# Altium schematic sheet STM32F103ZE.SchDoc
size A3
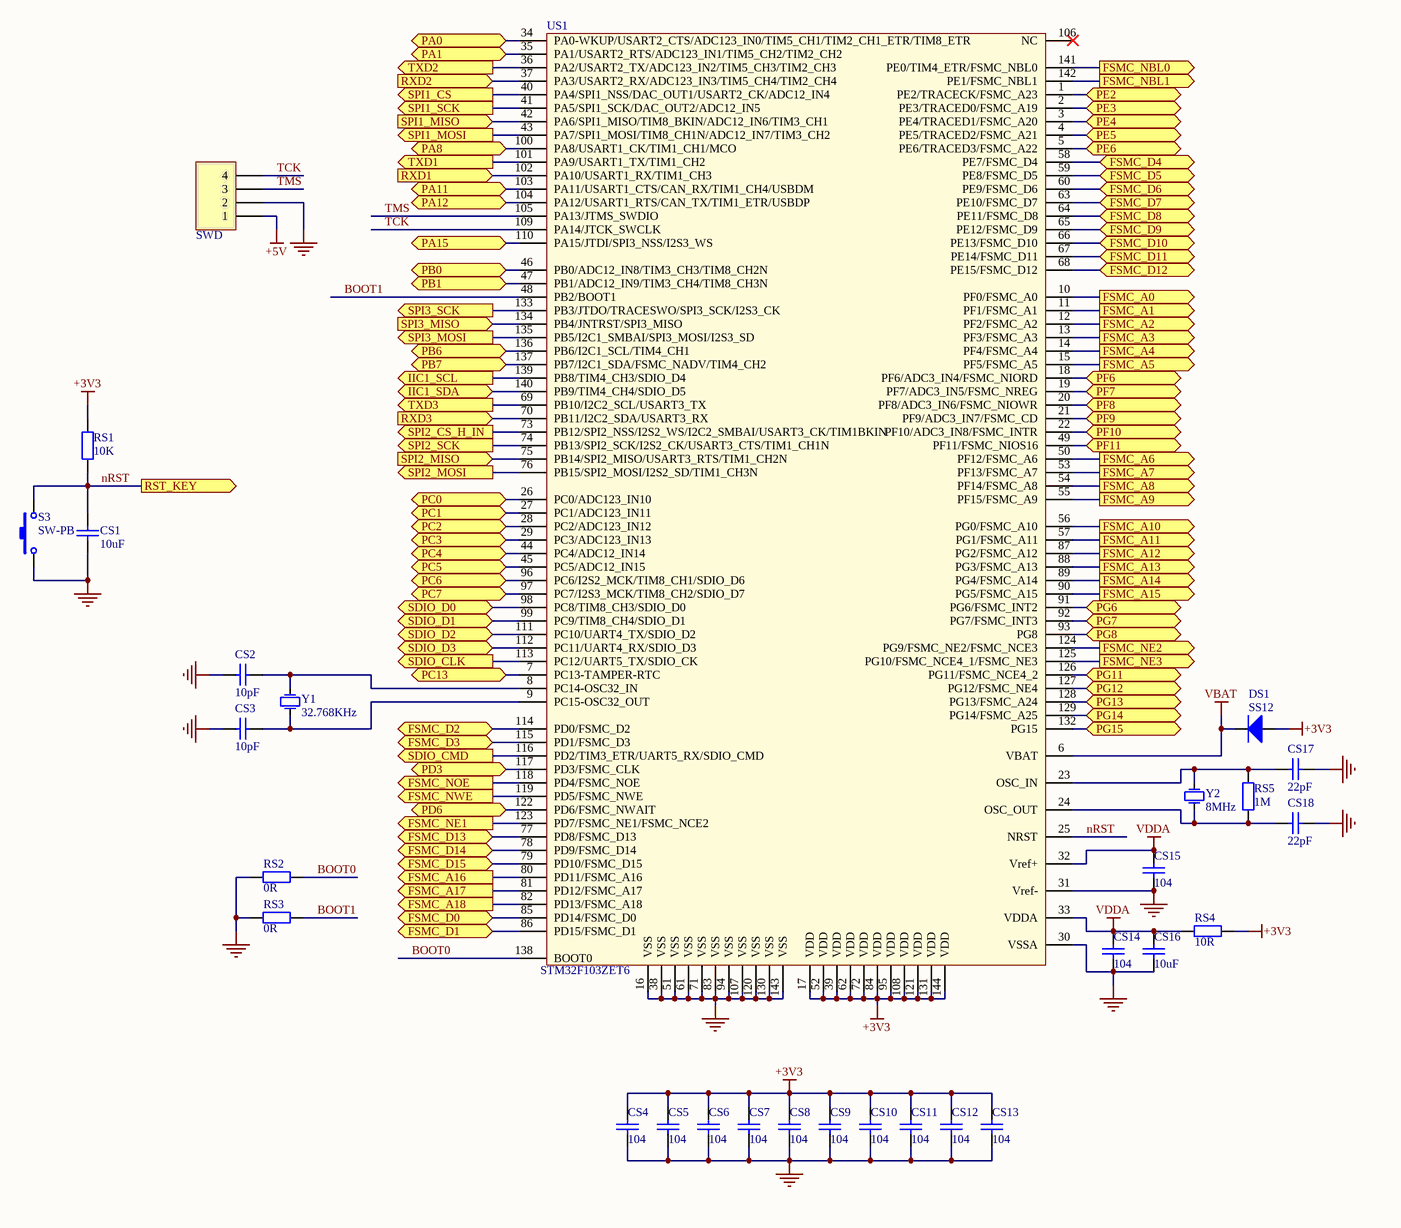
[diagram p0: STM32F103ZE.SchDoc]

## Parts
CS1  value 10uF  [CAPC1608N]  (hidden comment: Cap1)
CS2  value 10pF  [CAPC1608N]  (hidden comment: Cap1)
CS3  value 10pF  [CAPC1608N]  (hidden comment: Cap1)
CS4  value 104  [CAPC1608N]  (hidden comment: Cap1)
CS5  value 104  [CAPC1608N]  (hidden comment: Cap1)
CS6  value 104  [CAPC1608N]  (hidden comment: Cap1)
CS7  value 104  [CAPC1608N]  (hidden comment: Cap1)
CS8  value 104  [CAPC1608N]  (hidden comment: Cap1)
CS9  value 104  [CAPC1608N]  (hidden comment: Cap1)
CS10  value 104  [CAPC1608N]  (hidden comment: Cap1)
CS11  value 104  [CAPC1608N]  (hidden comment: Cap1)
CS12  value 104  [CAPC1608N]  (hidden comment: Cap1)
CS13  value 104  [CAPC1608N]  (hidden comment: Cap1)
CS14  value 104  [CAPC1608N]  (hidden comment: Cap1)
CS15  value 104  [CAPC1608N]  (hidden comment: Cap1)
CS16  value 10uF  [CAPC1608N]  (hidden comment: Cap1)
CS17  value 22pF  [CAPC1608N]  (hidden comment: Cap1)
CS18  value 22pF  [CAPC1608N]  (hidden comment: Cap1)
DS1  SMA: SS12  [DO-214AC]  (hidden comment: Diode)
RS1  value 10K  [RESC1608N]  (hidden comment: Res1)
RS2  value 0R  [RESC1608N]  (hidden comment: Res1)
RS3  value 0R  [RESC1608N]  (hidden comment: Res1)
RS4  value 10R  [RESC1608N]  (hidden comment: Res1)
RS5  value 1M  [RESC1608N]  (hidden comment: Res1)
S3  SW-PB  [SW-3x6]
SWD  Header 4  [HDR1X4]  (value not drawn)
US1  STM32F103ZET6  [LQFP144]
Y1  32.768KHz  [XTAL-206]
Y2  8MHz  [49S]

## Ports
FSMC_A0 (out), FSMC_A1 (out), FSMC_A2 (out), FSMC_A3 (out), FSMC_A4 (out), FSMC_A5 (out), FSMC_A6 (out), FSMC_A7 (out), FSMC_A8 (out), FSMC_A9 (out), FSMC_A10 (out), FSMC_A11 (out), FSMC_A12 (out), FSMC_A13 (out), FSMC_A14 (out), FSMC_A15 (out), FSMC_A16 (out), FSMC_A17 (out), FSMC_A18 (out), FSMC_D0 (bidir), FSMC_D1 (bidir), FSMC_D2 (bidir), FSMC_D3 (bidir), FSMC_D4 (bidir), FSMC_D5 (bidir), FSMC_D6 (bidir), FSMC_D7 (bidir), FSMC_D8 (bidir), FSMC_D9 (bidir), FSMC_D10 (bidir), FSMC_D11 (bidir), FSMC_D12 (bidir), FSMC_D13 (bidir), FSMC_D14 (bidir), FSMC_D15 (bidir), FSMC_NBL0 (out), FSMC_NBL1 (out), FSMC_NE1 (out), FSMC_NE2 (out), FSMC_NE3 (out), FSMC_NOE (out), FSMC_NWE (out), IIC1_SCL (out), IIC1_SDA (bidir), PA0 (bidir), PA1 (bidir), PA8 (bidir), PA11 (bidir), PA12 (bidir), PA15 (bidir), PB0 (bidir), PB1 (bidir), PB6 (bidir), PB7 (bidir), PC0 (bidir), PC1 (bidir), PC2 (bidir), PC3 (bidir), PC4 (bidir), PC5 (bidir), PC6 (bidir), PC7 (bidir), PC13 (bidir), PD3 (bidir), PD6 (bidir), PE2 (bidir), PE3 (bidir), PE4 (bidir), PE5 (bidir), PE6 (bidir), PF6 (bidir), PF7 (bidir), PF8 (bidir), PF9 (bidir), PF10 (bidir), PF11 (bidir), PG6 (bidir), PG7 (bidir), PG8 (bidir), PG11 (bidir), PG12 (bidir), PG13 (bidir), PG14 (bidir), PG15 (bidir), RST_KEY (out), RXD1 (in), RXD2 (in), RXD3 (in), SDIO_CLK (out), SDIO_CMD (out), SDIO_D0 (bidir), SDIO_D1 (bidir), SDIO_D2 (bidir), SDIO_D3 (bidir), SPI1_CS (out), SPI1_MISO (in), SPI1_MOSI (out), SPI1_SCK (out), SPI2_CS_H_IN (out), SPI2_MISO (in), SPI2_MOSI (out), SPI2_SCK (out), SPI3_MISO (in), SPI3_MOSI (out), SPI3_SCK (out), TXD1 (out), TXD2 (out), TXD3 (out)

## Nets
+3V3: CS4.2 CS5.2 CS6.2 CS7.2 CS8.2 CS9.2 CS10.2 CS11.2 CS12.2 CS13.2 DS1.1(A) RS1.2 RS4.2 US1.17(VDD) US1.39(VDD) US1.52(VDD) US1.62(VDD) US1.72(VDD) US1.84(VDD) US1.95(VDD) US1.108(VDD) US1.121(VDD) US1.131(VDD) US1.144(VDD)
+5V: SWD.1
GND: CS1.1 CS2.1 CS3.1 CS4.1 CS5.1 CS6.1 CS7.1 CS8.1 CS9.1 CS10.1 CS11.1 CS12.1 CS13.1 CS14.1 CS15.1 CS16.1 CS17.1 CS18.1 RS2.1 RS3.1 S3.1 SWD.2 US1.16(VSS) US1.30(VSSA) US1.31(Vref-) US1.38(VSS) US1.51(VSS) US1.61(VSS) US1.71(VSS) US1.83(VSS) US1.94(VSS) US1.107(VSS) US1.120(VSS) US1.130(VSS) US1.143(VSS)
VBAT: DS1.2(K) US1.6(VBAT)
VDDA: CS14.2 CS15.2 CS16.2 RS4.1 US1.32(Vref+) US1.33(VDDA)
BOOT0: RS2.2 US1.138(BOOT0)
BOOT1: RS3.2 US1.48(PB2/BOOT1)
FSMC_A0: US1.10(PF0/FSMC_A0) ; port FSMC_A0
FSMC_A1: US1.11(PF1/FSMC_A1) ; port FSMC_A1
FSMC_A2: US1.12(PF2/FSMC_A2) ; port FSMC_A2
FSMC_A3: US1.13(PF3/FSMC_A3) ; port FSMC_A3
FSMC_A4: US1.14(PF4/FSMC_A4) ; port FSMC_A4
FSMC_A5: US1.15(PF5/FSMC_A5) ; port FSMC_A5
FSMC_A6: US1.50(PF12/FSMC_A6) ; port FSMC_A6
FSMC_A7: US1.53(PF13/FSMC_A7) ; port FSMC_A7
FSMC_A8: US1.54(PF14/FSMC_A8) ; port FSMC_A8
FSMC_A9: US1.55(PF15/FSMC_A9) ; port FSMC_A9
FSMC_A10: US1.56(PG0/FSMC_A10) ; port FSMC_A10
FSMC_A11: US1.57(PG1/FSMC_A11) ; port FSMC_A11
FSMC_A12: US1.87(PG2/FSMC_A12) ; port FSMC_A12
FSMC_A13: US1.88(PG3/FSMC_A13) ; port FSMC_A13
FSMC_A14: US1.89(PG4/FSMC_A14) ; port FSMC_A14
FSMC_A15: US1.90(PG5/FSMC_A15) ; port FSMC_A15
FSMC_A16: US1.80(PD11/FSMC_A16) ; port FSMC_A16
FSMC_A17: US1.81(PD12/FSMC_A17) ; port FSMC_A17
FSMC_A18: US1.82(PD13/FSMC_A18) ; port FSMC_A18
FSMC_D0: US1.85(PD14/FSMC_D0) ; port FSMC_D0
FSMC_D1: US1.86(PD15/FSMC_D1) ; port FSMC_D1
FSMC_D2: US1.114(PD0/FSMC_D2) ; port FSMC_D2
FSMC_D3: US1.115(PD1/FSMC_D3) ; port FSMC_D3
FSMC_D4: US1.58(PE7/FSMC_D4) ; port FSMC_D4
FSMC_D5: US1.59(PE8/FSMC_D5) ; port FSMC_D5
FSMC_D6: US1.60(PE9/FSMC_D6) ; port FSMC_D6
FSMC_D7: US1.63(PE10/FSMC_D7) ; port FSMC_D7
FSMC_D8: US1.64(PE11/FSMC_D8) ; port FSMC_D8
FSMC_D9: US1.65(PE12/FSMC_D9) ; port FSMC_D9
FSMC_D10: US1.66(PE13/FSMC_D10) ; port FSMC_D10
FSMC_D11: US1.67(PE14/FSMC_D11) ; port FSMC_D11
FSMC_D12: US1.68(PE15/FSMC_D12) ; port FSMC_D12
FSMC_D13: US1.77(PD8/FSMC_D13) ; port FSMC_D13
FSMC_D14: US1.78(PD9/FSMC_D14) ; port FSMC_D14
FSMC_D15: US1.79(PD10/FSMC_D15) ; port FSMC_D15
FSMC_NBL0: US1.141(PE0/TIM4_ETR/FSMC_NBL0) ; port FSMC_NBL0
FSMC_NBL1: US1.142(PE1/FSMC_NBL1) ; port FSMC_NBL1
FSMC_NE1: US1.123(PD7/FSMC_NE1/FSMC_NCE2) ; port FSMC_NE1
FSMC_NE2: US1.124(PG9/FSMC_NE2/FSMC_NCE3) ; port FSMC_NE2
FSMC_NE3: US1.125(PG10/FSMC_NCE4_1/FSMC_NE3) ; port FSMC_NE3
FSMC_NOE: US1.118(PD4/FSMC_NOE) ; port FSMC_NOE
FSMC_NWE: US1.119(PD5/FSMC_NWE) ; port FSMC_NWE
IIC1_SCL: US1.139(PB8/TIM4_CH3/SDIO_D4) ; port IIC1_SCL
IIC1_SDA: US1.140(PB9/TIM4_CH4/SDIO_D5) ; port IIC1_SDA
nRST: CS1.2 RS1.1 S3.2 US1.25(NRST) ; port RST_KEY
PA0: US1.34(PA0-WKUP/USART2_CTS/ADC123_IN0/TIM5_CH1/TIM2_CH1_ETR/TIM8_ETR) ; port PA0
PA1: US1.35(PA1/USART2_RTS/ADC123_IN1/TIM5_CH2/TIM2_CH2) ; port PA1
PA8: US1.100(PA8/USART1_CK/TIM1_CH1/MCO) ; port PA8
PA11: US1.103(PA11/USART1_CTS/CAN_RX/TIM1_CH4/USBDM) ; port PA11
PA12: US1.104(PA12/USART1_RTS/CAN_TX/TIM1_ETR/USBDP) ; port PA12
PA15: US1.110(PA15/JTDI/SPI3_NSS/I2S3_WS) ; port PA15
PB0: US1.46(PB0/ADC12_IN8/TIM3_CH3/TIM8_CH2N) ; port PB0
PB1: US1.47(PB1/ADC12_IN9/TIM3_CH4/TIM8_CH3N) ; port PB1
PB6: US1.136(PB6/I2C1_SCL/TIM4_CH1) ; port PB6
PB7: US1.137(PB7/I2C1_SDA/FSMC_NADV/TIM4_CH2) ; port PB7
PC0: US1.26(PC0/ADC123_IN10) ; port PC0
PC1: US1.27(PC1/ADC123_IN11) ; port PC1
PC2: US1.28(PC2/ADC123_IN12) ; port PC2
PC3: US1.29(PC3/ADC123_IN13) ; port PC3
PC4: US1.44(PC4/ADC12_IN14) ; port PC4
PC5: US1.45(PC5/ADC12_IN15) ; port PC5
PC6: US1.96(PC6/I2S2_MCK/TIM8_CH1/SDIO_D6) ; port PC6
PC7: US1.97(PC7/I2S3_MCK/TIM8_CH2/SDIO_D7) ; port PC7
PC13: US1.7(PC13-TAMPER-RTC) ; port PC13
PD3: US1.117(PD3/FSMC_CLK) ; port PD3
PD6: US1.122(PD6/FSMC_NWAIT) ; port PD6
PE2: US1.1(PE2/TRACECK/FSMC_A23) ; port PE2
PE3: US1.2(PE3/TRACED0/FSMC_A19) ; port PE3
PE4: US1.3(PE4/TRACED1/FSMC_A20) ; port PE4
PE5: US1.4(PE5/TRACED2/FSMC_A21) ; port PE5
PE6: US1.5(PE6/TRACED3/FSMC_A22) ; port PE6
PF6: US1.18(PF6/ADC3_IN4/FSMC_NIORD) ; port PF6
PF7: US1.19(PF7/ADC3_IN5/FSMC_NREG) ; port PF7
PF8: US1.20(PF8/ADC3_IN6/FSMC_NIOWR) ; port PF8
PF9: US1.21(PF9/ADC3_IN7/FSMC_CD) ; port PF9
PF10: US1.22(PF10/ADC3_IN8/FSMC_INTR) ; port PF10
PF11: US1.49(PF11/FSMC_NIOS16) ; port PF11
PG6: US1.91(PG6/FSMC_INT2) ; port PG6
PG7: US1.92(PG7/FSMC_INT3) ; port PG7
PG8: US1.93(PG8) ; port PG8
PG11: US1.126(PG11/FSMC_NCE4_2) ; port PG11
PG12: US1.127(PG12/FSMC_NE4) ; port PG12
PG13: US1.128(PG13/FSMC_A24) ; port PG13
PG14: US1.129(PG14/FSMC_A25) ; port PG14
PG15: US1.132(PG15) ; port PG15
RXD1: US1.102(PA10/USART1_RX/TIM1_CH3) ; port RXD1
RXD2: US1.37(PA3/USART2_RX/ADC123_IN3/TIM5_CH4/TIM2_CH4) ; port RXD2
RXD3: US1.70(PB11/I2C2_SDA/USART3_RX) ; port RXD3
SDIO_CLK: US1.113(PC12/UART5_TX/SDIO_CK) ; port SDIO_CLK
SDIO_CMD: US1.116(PD2/TIM3_ETR/UART5_RX/SDIO_CMD) ; port SDIO_CMD
SDIO_D0: US1.98(PC8/TIM8_CH3/SDIO_D0) ; port SDIO_D0
SDIO_D1: US1.99(PC9/TIM8_CH4/SDIO_D1) ; port SDIO_D1
SDIO_D2: US1.111(PC10/UART4_TX/SDIO_D2) ; port SDIO_D2
SDIO_D3: US1.112(PC11/UART4_RX/SDIO_D3) ; port SDIO_D3
SPI1_CS: US1.40(PA4/SPI1_NSS/DAC_OUT1/USART2_CK/ADC12_IN4) ; port SPI1_CS
SPI1_MISO: US1.42(PA6/SPI1_MISO/TIM8_BKIN/ADC12_IN6/TIM3_CH1) ; port SPI1_MISO
SPI1_MOSI: US1.43(PA7/SPI1_MOSI/TIM8_CH1N/ADC12_IN7/TIM3_CH2) ; port SPI1_MOSI
SPI1_SCK: US1.41(PA5/SPI1_SCK/DAC_OUT2/ADC12_IN5) ; port SPI1_SCK
SPI2_CS_H_IN: US1.73(PB12/SPI2_NSS/I2S2_WS/I2C2_SMBAI/USART3_CK/TIM1BKIN) ; port SPI2_CS_H_IN
SPI2_MISO: US1.75(PB14/SPI2_MISO/USART3_RTS/TIM1_CH2N) ; port SPI2_MISO
SPI2_MOSI: US1.76(PB15/SPI2_MOSI/I2S2_SD/TIM1_CH3N) ; port SPI2_MOSI
SPI2_SCK: US1.74(PB13/SPI2_SCK/I2S2_CK/USART3_CTS/TIM1_CH1N) ; port SPI2_SCK
SPI3_MISO: US1.134(PB4/JNTRST/SPI3_MISO) ; port SPI3_MISO
SPI3_MOSI: US1.135(PB5/I2C1_SMBAI/SPI3_MOSI/I2S3_SD) ; port SPI3_MOSI
SPI3_SCK: US1.133(PB3/JTDO/TRACESWO/SPI3_SCK/I2S3_CK) ; port SPI3_SCK
TCK: SWD.4 US1.109(PA14/JTCK_SWCLK)
TMS: SWD.3 US1.105(PA13/JTMS_SWDIO)
TXD1: US1.101(PA9/USART1_TX/TIM1_CH2) ; port TXD1
TXD2: US1.36(PA2/USART2_TX/ADC123_IN2/TIM5_CH3/TIM2_CH3) ; port TXD2
TXD3: US1.69(PB10/I2C2_SCL/USART3_TX) ; port TXD3
NetCS2_2: CS2.2 US1.8(PC14-OSC32_IN) Y1.2(OSC2)
NetCS3_2: CS3.2 US1.9(PC15-OSC32_OUT) Y1.1(OSC1)
NetCS17_2: CS17.2 RS5.2 US1.23(OSC_IN) Y2.2(OSC2)
NetCS18_2: CS18.2 RS5.1 US1.24(OSC_OUT) Y2.1(OSC1)

Not connected (* = marked no-connect by the designer): US1 106(NC)*

## Library data of the parts
CS1-CS18 = Cap1: Capacitor; Published: 8-Jun-2000; LatestRevisionDate: 17-Jul-2002; LatestRevisionNote: Re-released for DXP Platform.; PackageReference: RAD-0.3; Publisher: Altium Limited
RS1-RS5 = Res1: Resistor; Published: 8-Jun-2000; LatestRevisionDate: 17-Jul-2002; LatestRevisionNote: Re-released for DXP Platform.; PackageReference: AXIAL-0.4; Publisher: Altium Limited
S3 = SW-PB: Switch; Published: 24-Mar-1999; LatestRevisionDate: 17-Jul-2002; LatestRevisionNote: Re-released for DXP Platform.; PackageReference: SPST-2; Publisher: Altium Limited; PackageDescription: Switch; 2 Leads
SWD = Header 4: Header, 4-Pin; LatestRevisionDate: 17-Jul-2002; LatestRevisionNote: Re-released for DXP Platform.; Publisher: Altium Limited
Y1 Y2 = XTAL: Crystal Oscillator; Published: 8-Jun-2000; LatestRevisionDate: 17-Jul-2002; LatestRevisionNote: Re-released for DXP Platform.; PackageReference: R38; Publisher: Altium Limited; PackageDescription: Crystal, Thru-Hole; 2 Leads; Body 3.1 x 8.2 mm (Dia.xH)